# EAGLE schematic robomow_city120_terminal (EAGLE 9.4.2)
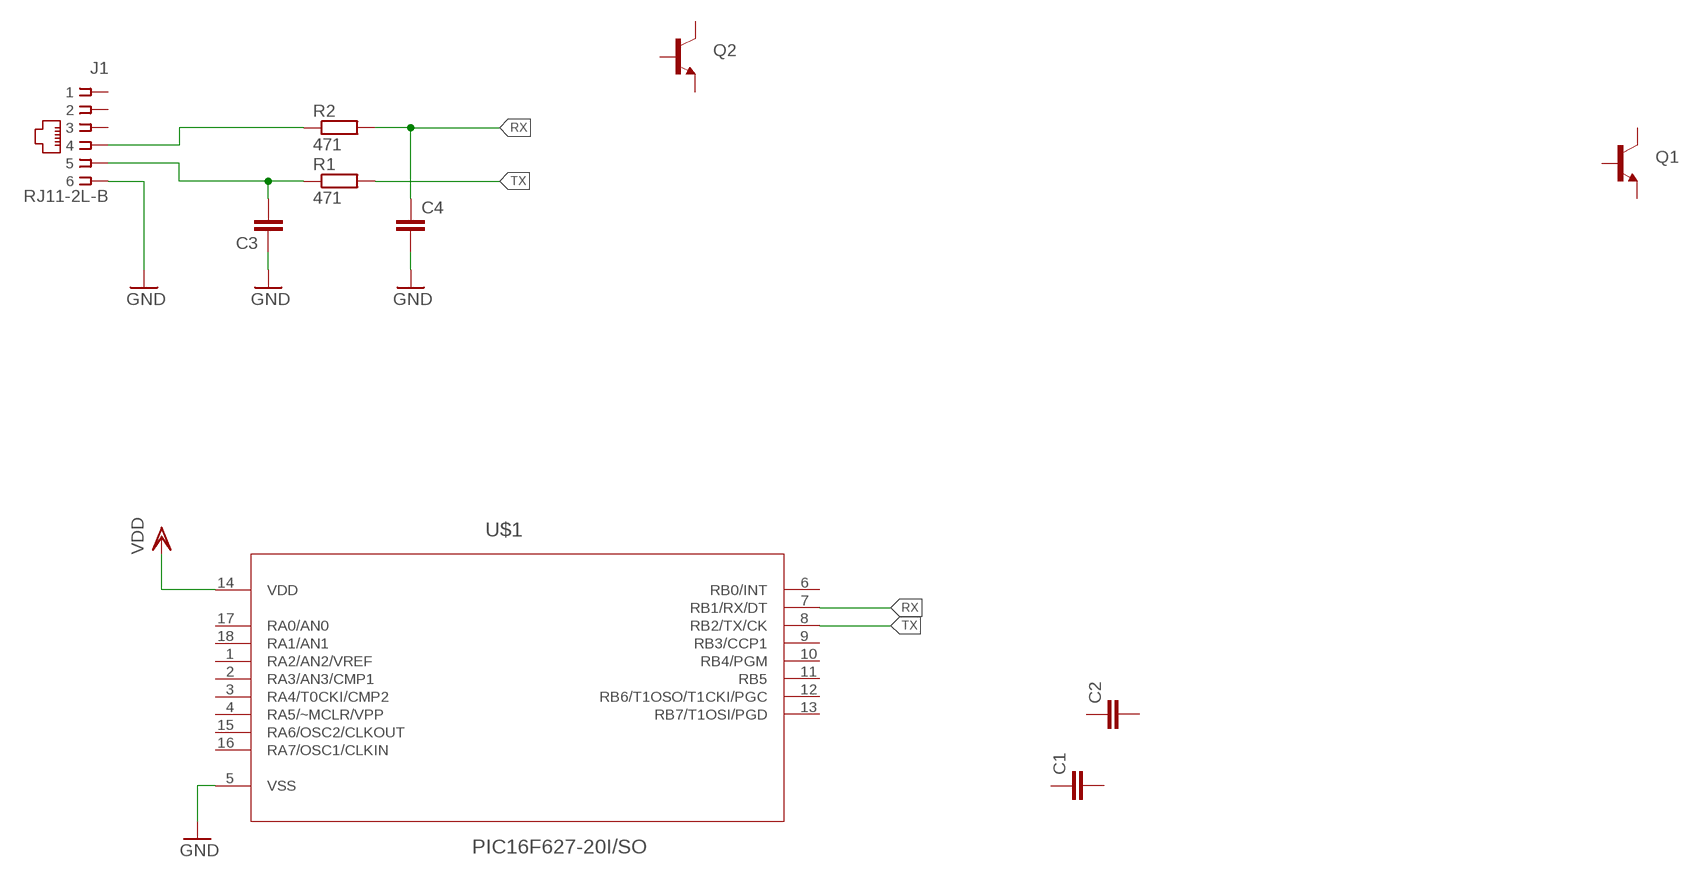
[diagram p0: schematic, sheet 1]

## Parts
C1  C-EUC0805  [C0805]
C2  C-EUC0805  [C0805]
C3  C-EUC0805  [C0805]
C4  C-EUC0805  [C0805]
J1  RJ11-2L-B  [RJ11-NO_SHIELD]
Q1  TRANSISTOR_NPNSOT89  [SOT89]
Q2  TRANSISTOR_NPNSOT89  [SOT89]
R1  471  R-EU_R0805  [R0805]
R2  471  R-EU_R0805  [R0805]
U$1  PIC16F627-20I/SO  [SOIC127P1030X265-18N]

## Nets
GND: C3.1 C4.2 J1.6 U$1.5(VSS)
RX: C4.1 R2.2 U$1.7(RB1/RX/DT)
RX_R: J1.4 R2.1
TX: R1.2 U$1.8(RB2/TX/CK)
TX_R: C3.2 J1.5 R1.1
VDD: U$1.14(VDD)
Unconnected: C1.1 C1.2 C2.1 C2.2 J1.1 J1.2 J1.3 Q1.1(B) Q1.2(C) Q1.3(E) Q2.1(B) Q2.2(C) Q2.3(E) U$1.1(RA2/AN2/VREF) U$1.2(RA3/AN3/CMP1) U$1.3(RA4/T0CKI/CMP2) U$1.4(RA5/~MCLR/VPP) U$1.6(RB0/INT) U$1.9(RB3/CCP1) U$1.10(RB4/PGM) U$1.11(RB5) U$1.12(RB6/T1OSO/T1CKI/PGC) U$1.13(RB7/T1OSI/PGD) U$1.15(RA6/OSC2/CLKOUT) U$1.16(RA7/OSC1/CLKIN) U$1.17(RA0/AN0) U$1.18(RA1/AN1)

## Library data of the parts
C1-C4 = rcl:C-EU: CAPACITOR, European symbol
J1 = con-tycoelectronics:RJ11: CORCOM Modular RJ Jacks No Shield Source: www.tycoelectronics.com .. ENG_DS_1654001_1099_RJ_L_0507.pdf; MF: TYCO ELECTRONICS; MPN: RJ11-2L-B; OC_FARNELL: unknown; OC_NEWARK: 83F4463
Q1 Q2 = SparkFun:TRANSISTOR_NPN: Transistor NPN BJT configuration in SOT23 package. MMBT2222 is the common NPN we use. Double check BCE configuration again layout.
R1 R2 = rcl:R-EU_: RESISTOR, European symbol
U$1 = Microchip_By_element14_Batch_1:PIC16F627-20I/SO: 8 Bit CMOS Microcontrollers; DESCRIPTION: 8 Bit CMOS Microcontrollers; MPN: PIC16F627-20I/SO; OC_FARNELL: 1084265; OC_NEWARK: 23C4968; PACKAGE: SOIC-18; SUPPLIER: Microchip